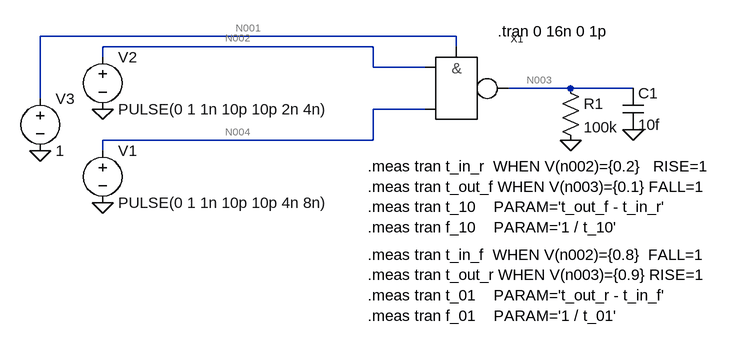
[diagram p0: schematic nand2_test.asc]
nand2_test.asc, the LTspice schematic file:
Version 4.1
SHEET 1 1328 680
WIRE 96 -176 -544 -176
WIRE -32 -160 -448 -160
WIRE 96 -160 96 -176
WIRE -448 -144 -448 -160
WIRE -32 -128 -32 -160
WIRE 48 -128 -32 -128
WIRE 272 -96 176 -96
WIRE 368 -96 272 -96
WIRE -544 -80 -544 -176
WIRE 48 -64 -32 -64
WIRE -32 -16 -32 -64
WIRE -32 -16 -448 -16
WIRE -448 0 -448 -16
FLAG -544 0 0
FLAG -448 80 0
FLAG -448 -64 0
FLAG 272 -16 0
FLAG 368 -32 0
SYMBOL voltage -544 -96 R0
SYMATTR InstName V3
SYMATTR Value 1
SYMBOL voltage -448 -160 R0
WINDOW 123 0 0 Left 0
WINDOW 39 0 0 Left 0
SYMATTR InstName V2
SYMATTR Value PULSE(0 1 1n 10p 10p 2n 4n)
SYMBOL voltage -448 -16 R0
WINDOW 123 0 0 Left 0
WINDOW 39 0 0 Left 0
SYMATTR InstName V1
SYMATTR Value PULSE(0 1 1n 10p 10p 4n 8n)
SYMBOL nand2 96 -96 R0
SYMATTR InstName X1
SYMATTR SpiceLine T_SIZE=8
SYMBOL res 256 -112 R0
SYMATTR InstName R1
SYMATTR Value 100k
SYMBOL cap 352 -96 R0
SYMATTR InstName C1
SYMATTR Value 10f
TEXT 160 -184 Left 2 !.tran 0 16n 0 1p
TEXT -40 24 Left 2 !.meas tran t_in_r  WHEN V(n002)={0.2}   RISE=1 \n.meas tran t_out_f WHEN V(n003)={0.1} FALL=1 \n.meas tran t_10    PARAM='t_out_f - t_in_r'\n.meas tran f_10    PARAM='1 / t_10'
TEXT -40 160 Left 2 !.meas tran t_in_f  WHEN V(n002)={0.8}  FALL=1\n.meas tran t_out_r WHEN V(n003)={0.9} RISE=1\n.meas tran t_01    PARAM='t_out_r - t_in_f'\n.meas tran f_01    PARAM='1 / t_01'

The netlist it stands for:
* nand2_test.asc
V3 N001 0 1
V2 N002 0 PULSE(0 1 1n 10p 10p 2n 4n)
V1 N004 0 PULSE(0 1 1n 10p 10p 4n 8n)
X§X1 N001 N002 N004 N003 nand2 T_SIZE=8  ; pins VDD A B Y
R1 N003 0 100k
C1 N003 0 10f
.tran 0 16n 0 1p
.meas tran t_in_r  WHEN V(n002)={0.2}   RISE=1
.meas tran t_out_f WHEN V(n003)={0.1} FALL=1
.meas tran t_10    PARAM='t_out_f - t_in_r'
.meas tran f_10    PARAM='1 / t_10'
.meas tran t_in_f  WHEN V(n002)={0.8}  FALL=1
.meas tran t_out_r WHEN V(n003)={0.9} RISE=1
.meas tran t_01    PARAM='t_out_r - t_in_f'
.meas tran f_01    PARAM='1 / t_01'
.backanno
.end

* Results of the author's LTspice run, read from the files saved beside the schematic
* Operating Point, zero values left out:
*   V(n003) = 986.9 mV
*   V(n001) = 1 V
*   I(V1) = 2.839 pA
*   I(V3) = -9.869 µA
*   I(R1) = 9.869 µA
*   I(V2) = 120.7 pA
*   Ix(x1:vdd) = 9.869 µA
*   Ix(x1:a) = -120.7 pA
*   Ix(x1:b) = -2.839 pA
*   Ix(x1:y) = -9.869 µA
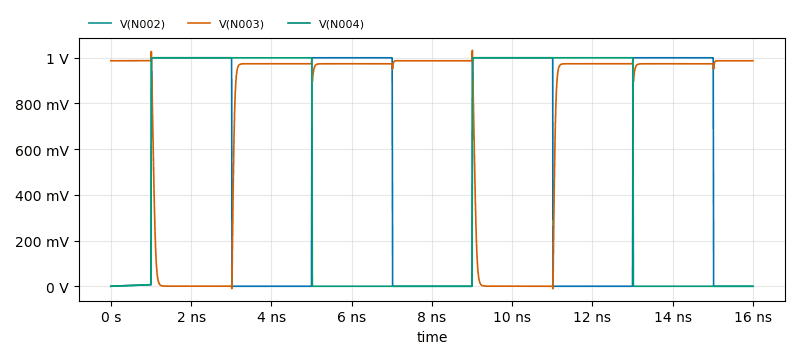
[diagram p1: Transient Analysis of nand2_test.asc, plotted from the saved traces]
* Transient Analysis, 1 run:
*   V(N002): min 0 V, max 1 V, average 502.5 mV, rms 708.3 mV, last 0 V
*   V(N003): min -11.13 mV, max 1.033 V, average 735 mV, rms 844.6 mV, last 986.8 mV
*   V(N004): min 0 V, max 1 V, average 501.2 mV, rms 707.7 mV, last 0 V
* From the log:
*   t_in_r: V(n002)={0.2} AT 1.00200000004e-09
*   t_out_f: V(n003)={0.1} AT 1.13315956421e-09
*   t_10: 't_out_f - t_in_r'=1.31159564169e-10
*   f_10: '1 / t_10'=7624301028.58
*   t_in_f: V(n002)={0.8} AT 3.01200000017e-09
*   t_out_r: V(n003)={0.9} AT 3.11738525172e-09
*   t_01: 't_out_r - t_in_f'=1.05385251555e-10
*   f_01: '1 / t_01'=9488993813.11